# EAGLE design ESP-01-WLED Shield - double Level shift0.1 (EAGLE 9.6.2)
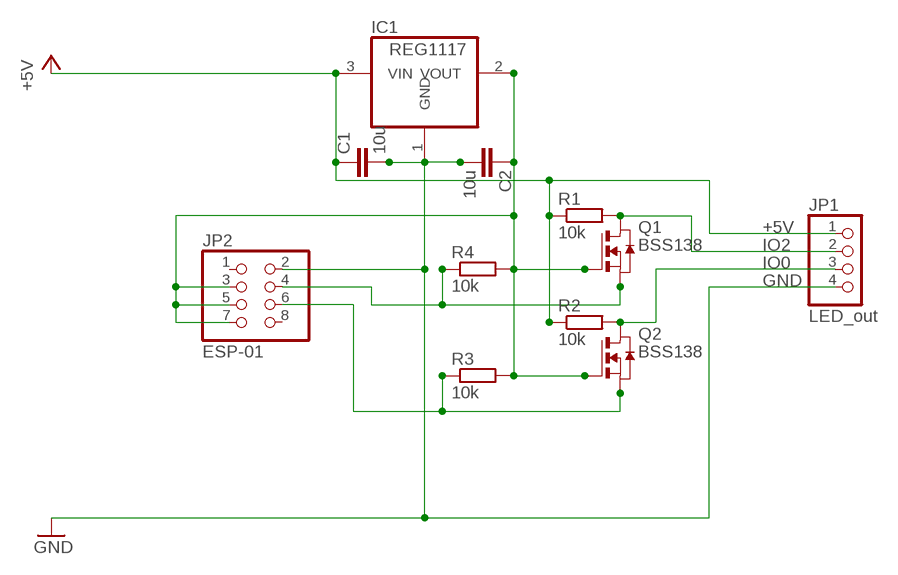
[diagram p0: schematic, sheet 1]

## Parts
C1  10u  C-EUC0805K  [C0805K]
C2  10u  C-EUC0805K  [C0805K]
IC1  REG1117  [SOT223]
JP1  LED_out  PINHD-1X4/90  [1X04/90]
JP2  ESP-01  PINHD-2X4  [2X04]
Q1  BSS138  NMOSSOT23  [SOT-23]
Q2  BSS138  NMOSSOT23  [SOT-23]
R1  10k  R-EU_R0402  [R0402]
R2  10k  R-EU_R0402  [R0402]
R3  10k  R-EU_R0402  [R0402]
R4  10k  R-EU_R0402  [R0402]

## Nets
+5V: C1.1 IC1.3(VIN) JP1.1 R1.1 R2.1
GND: C1.2 C2.2 IC1.1(GND) JP1.4 JP2.2
IO0: JP1.3 Q2.1(D) R2.2
IO2: JP1.2 Q1.1(D) R1.2
N$1: C2.1 IC1.2(VOUT) JP2.3 JP2.5 JP2.7 Q1.3(G) Q2.3(G) R3.2 R4.2
N$2: JP2.4 Q1.2(S) R4.1
N$3: JP2.6 Q2.2(S) R3.1
Unconnected: JP2.1 JP2.8

## Library data of the parts
C1 C2 = rcl:C-EU: CAPACITOR, European symbol; SPICEPREFIX: C
IC1 = burr-brown:REG1117: 800mA and 1A Low Dropout (LDO) Positive Regulator 1.8V, 2.5V, 2.85V, 3.3V, 5V, and Adj; MPN: REG1117; OC_FARNELL: 1097566; OC_NEWARK: 14P6981
JP1 = pinhead:PINHD-1X4: PIN HEADER
JP2 = pinhead:PINHD-2X4: PIN HEADER
Q1 Q2 = zetex:NMOSSOT23: MOS FET; OC_FARNELL: unknown; OC_NEWARK: unknown
R1-R4 = rcl:R-EU_: RESISTOR, European symbol; SPICEPREFIX: R

## Net classes
0 default: clearance 0.205 mm

## Board
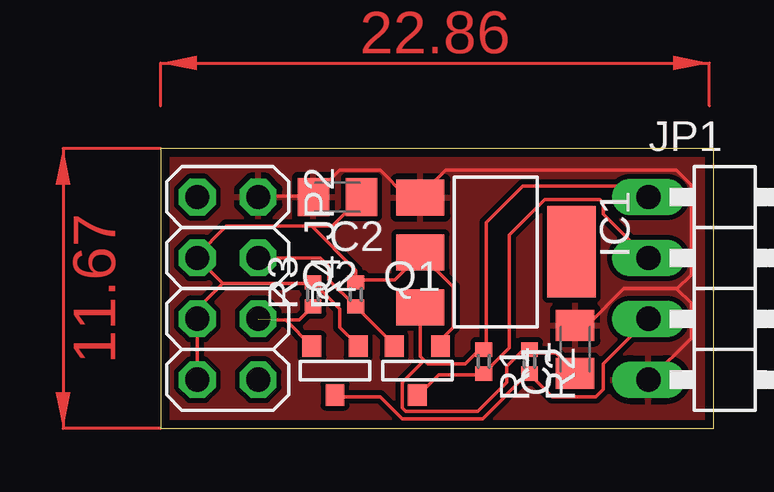
[diagram p1: board, top side]

Size 23.04 x 11.67 mm. Coordinates in mm from the lower left corner, seen from the top.
Outline: 0,0 23.04,0 23.04,11.67 0,11.67 0,0
Copper layers (1*16): Top 0.035mm / dielectric 1.5mm / Bottom 0.035mm
Design rules "default *": minimum track width 6mil, minimum drill 0.35mm, track to track 6mil, track to pad 6mil, pad to pad 6mil, via to via 6mil, smd to smd 6mil, copper to edge 0.35mm, drill to drill 6mil, minimum pad ring 10mil, minimum via ring 8mil, stop-mask expansion 4mil, vias tented up to drill 0mil, thermal gap 10mil

### Footprints (pad centres in the part's own frame; a part is rotated, then mirrored left to right if it is on the bottom)
C0805K = smd 1.3 x 1.6: 1 -1,0; 2 1,0
SOT223 = smd 1.499 x 2.007: 1 -2.261,-3.15; 2 0.025,-3.15; 3 2.311,-3.15 | smd 3.81 x 2.007: 4 0,3.15
1X04/90 = drill 1.016 long: 1 -3.81,-3.81; 2 -1.27,-3.81; 3 1.27,-3.81; 4 3.81,-3.81
2X04 = drill 1.016 octagon: 1 -3.81,-1.27; 2 -3.81,1.27; 3 -1.27,-1.27; 4 -1.27,1.27; 5 1.27,-1.27; 6 1.27,1.27; 7 3.81,-1.27; 8 3.81,1.27
SOT-23 = smd 0.787 x 0.889: 1 0.025,-1.016; 2 -0.94,1.016; 3 0.991,1.016
R0402 = smd 0.6 x 0.7: 1 -0.5,0; 2 0.5,0

### Placement (x,y rotation side)
C1  17.27,3.3 90 top
C2  7.37,9.65 180 top
IC1  13.97,7.37 270 top
JP1  24.13,5.84 270 top
JP2  2.79,5.84 270 top
Q1  10.67,2.41 0 top
Q2  7.24,2.41 0 top
R1  13.46,2.79 270 top
R2  15.37,2.79 270 top
R3  6.35,5.59 90 top
R4  8.13,5.59 90 top

### Tracks (layer width: path | path; a pad name or v marks a point on that pad's centre or on a via)
+5V
  Top 0.152: C1.1 17.22,2.39 16.46,3.15 15.39,3.15 R2.1 15.13,3.29 14.43,2.59 14.43,1.93 13.21,0.71 10.21,0.71 10.06,0.86 10.06,1.93 10.97,2.84 | 10.97,2.84 10.82,3 IC1.3 | 10.97,2.84 11.12,2.69 12.7,2.69 13.16,3.15 13.41,3.15 R1.1 13.56,3.3 13.56,8.58 15.09,10.11 19.86,10.11 JP1.1
GND
  Top 0.152: 21.49,5.84 19.3,5.84 17.83,4.37 17.37,4.37 C1.2 | JP1.4 20.42,2.08 22.1,3.76 22.1,5.23 21.51,5.82 22.1,6.4 22.1,10.16 21.49,10.77 11.89,10.77 10.82,9.7 | JP2.2 4.12,9.7 6.25,9.7 C2.2 6.4,9.7 7.47,10.77 9.14,10.77 10.21,9.7 10.82,9.7 | 10.82,9.7 IC1.1
  pour Top: 0.25,11.43 0.25,0.25 22.86,0.25 22.86,11.43
IO0
  Top 0.152: JP1.3 18.44,2.69 18.44,1.63 18.14,1.32 16.31,1.32 15.39,2.23 R2.2 15.24,2.23 13.41,0.41 10.06,0.41 9.14,1.32 7.31,1.32 Q2.1
IO2
  Top 0.152: Q1.1 10.82,1.47 11.58,2.23 13.41,2.23 R1.2 14.53,3.35 14.53,8.08 16,9.55 18.29,9.55 18.44,9.4 18.44,8.94 20.27,7.11 JP1.2
N$1
  Top 0.152: 8.38,6.2 9.75,6.2 10.82,7.26 | 8.38,6.2 8.23,6.2 R4.2 | 10.82,7.26 12.19,5.89 12.19,4.22 11.73,3.76 11.73,3.45 Q1.3 | 10.82,7.26 IC1.2 | R4.2 8.13,6.6 6.29,8.43 5.59,8.43 | C2.1 7.15,8.43 5.59,8.43 | 8.38,6.2 R4.2 | JP2.7 JP2.5 1.52,4.98 2.59,6.04 | Q2.3 8.23,3.45 7.47,4.22 7.47,4.98 6.4,6.04 R3.2 6.25,6.04 2.59,6.04 | 2.59,6.04 JP2.3 1.47,7.16 2.74,8.43 5.59,8.43
N$2
  Top 0.152: Q1.2 9.75,3.45 8.23,4.98 R4.1 8.08,5.13 7.01,6.2 7.01,6.76 6.65,7.11 JP2.4
N$3  (1 unrouted)
  Top 0.152: Q2.2 5.21,4.52 5.13,4.52 | R3.1 5.78,4.52 4.12,4.52 JP2.6
(copper drawn outside any net)
  shapes: Top area x2